# Altium schematic sheet MA-USBC.SchDoc
size A4; SheetNumber: 7; SheetTotal: 7
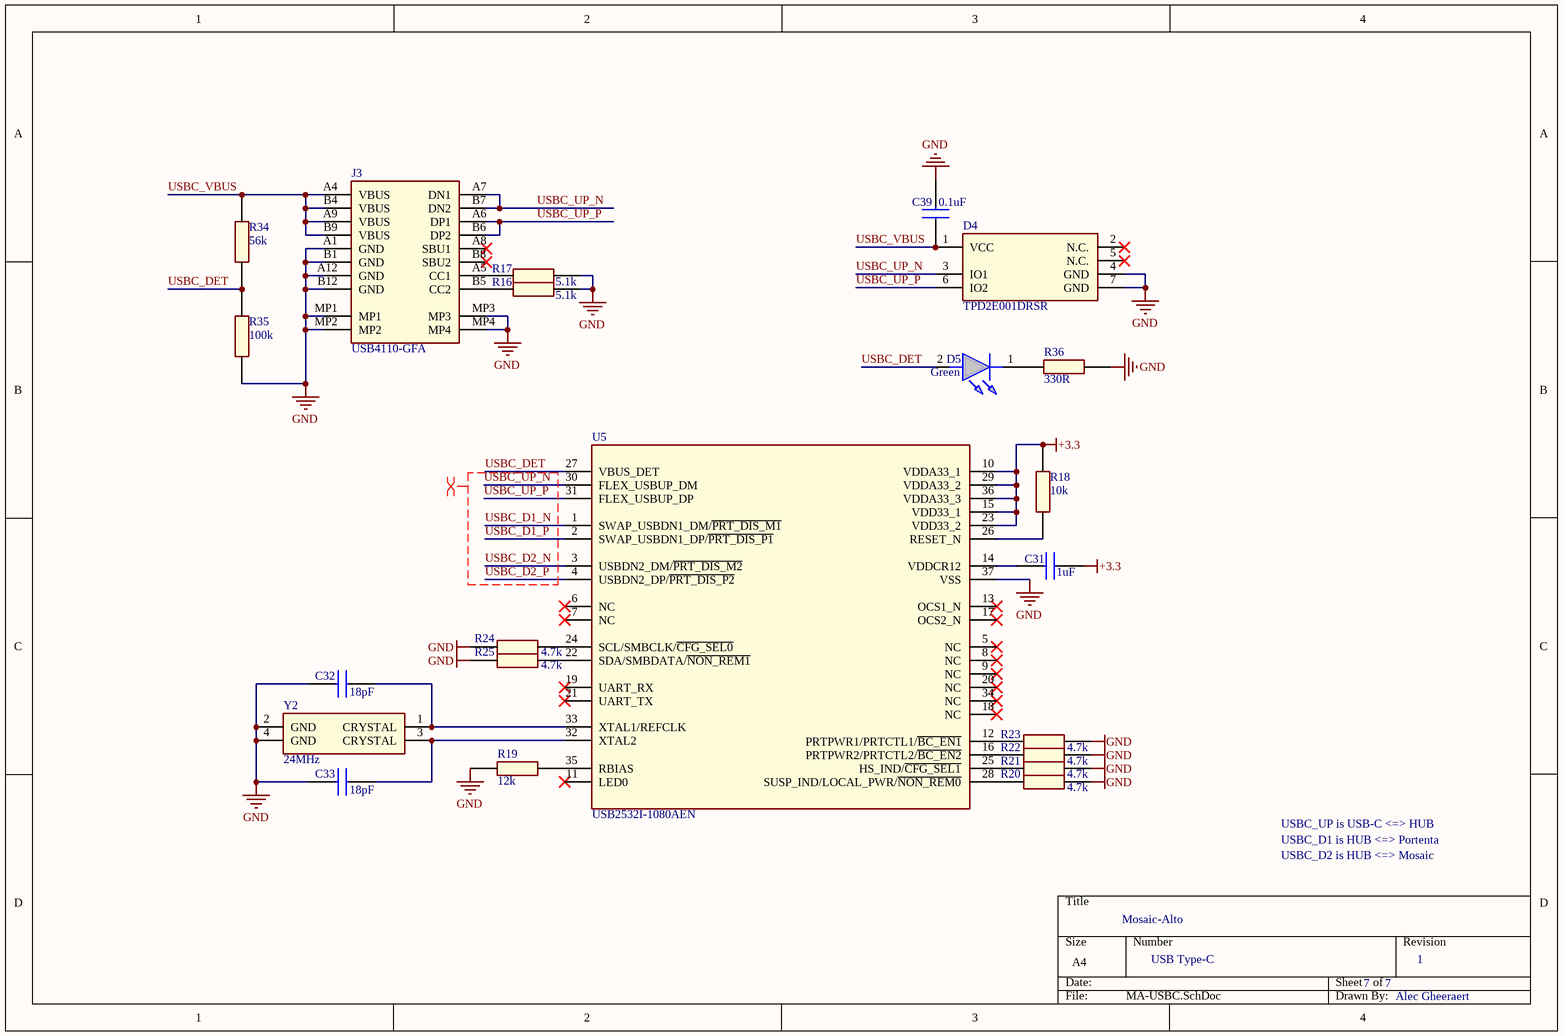
[diagram p0: MA-USBC.SchDoc]

## Parts
C31  1uF  [CAPC1608X100N]
C32  18pF  [CAPC1608X87N]
C33  18pF  [CAPC1608X87N]
C39  0.1uF  [CAPC2012X145N]
D4  TPD2E001DRSR  [SON95P300X300X80-7N-D]
D5  Green  [APT1608ZGCAMT]
J3  USB4110-GFA  [USB4110-GFA]
R16  5.1k  [RESC1608X60N]
R17  5.1k  [RESC1608X60N]
R18  10k  [RESC1005X40N]
R19  12k  [RESC1005X40N]
R20  4.7k  [RESC1005X40N]
R21  4.7k  [RESC1005X40N]
R22  4.7k  [RESC1005X40N]
R23  4.7k  [RESC1005X40N]
R24  4.7k  [RESC1005X40N]
R25  4.7k  [RESC1005X40N]
R34  56k  [RESC1005X40N]
R35  100k  [RESC1005X40N]
R36  330R  [RESC1005X40N]
U5  USB2532I-1080AEN  [QFN50P600X600X100-37N-D]
Y2  24MHz  [LFXTAL071257Reel]

## Nets
+3.3: C31.2 R18.2 U5.10(VDDA33_1) U5.15(VDD33_1) U5.23(VDD33_2) U5.29(VDDA33_2) U5.36(VDDA33_3)
GND: C32.1 C33.1 C39.2 D4.4(GND) D4.7(GND) J3.A1(GND) J3.A12(GND) J3.B1(GND) J3.B12(GND) J3.MP1 J3.MP2 J3.MP3 J3.MP4 R16.2 R17.2 R19.2 R20.2 R21.2 R22.2 R23.2 R24.1 R25.1 R35.2 R36.2 U5.37(VSS) Y2.2(GND) Y2.4(GND)
USBC_D1_N: U5.1(SWAP_USBDN1_DM/~{PRT_DIS_M1})
USBC_D1_P: U5.2(SWAP_USBDN1_DP/~{PRT_DIS_P1})
USBC_D2_N: U5.3(USBDN2_DM/~{PRT_DIS_M2})
USBC_D2_P: U5.4(USBDN2_DP/~{PRT_DIS_P2})
USBC_DET: D5.2(A) R34.2 R35.1 U5.27(VBUS_DET)
USBC_UP_N: D4.3(IO1) J3.A7(DN1) J3.B7(DN2) U5.30(FLEX_USBUP_DM)
USBC_UP_P: D4.6(IO2) J3.A6(DP1) J3.B6(DP2) U5.31(FLEX_USBUP_DP)
USBC_VBUS: C39.1 D4.1(VCC) J3.A4(VBUS) J3.A9(VBUS) J3.B4(VBUS) J3.B9(VBUS) R34.1
NetC31_1: C31.1 U5.14(VDDCR12)
NetC32_2: C32.2 U5.33(XTAL1/REFCLK) Y2.1(CRYSTAL)
NetC33_2: C33.2 U5.32(XTAL2) Y2.3(CRYSTAL)
NetD5_1: D5.1(K) R36.1
NetJ3_A5: J3.A5(CC1) R17.1
NetJ3_B5: J3.B5(CC2) R16.1
NetR18_1: R18.1 U5.26(RESET_N)
NetR19_1: R19.1 U5.35(RBIAS)
NetR20_1: R20.1 U5.28(SUSP_IND/LOCAL_PWR/~{NON_REM0})
NetR21_1: R21.1 U5.25(HS_IND/~{CFG_SEL1})
NetR22_1: R22.1 U5.16(PRTPWR2/PRTCTL2/~{BC_EN2})
NetR23_1: R23.1 U5.12(PRTPWR1/PRTCTL1/~{BC_EN1})
NetR24_2: R24.2 U5.24(SCL/SMBCLK/~{CFG_SEL0})
NetR25_2: R25.2 U5.22(SDA/SMBDATA/~{NON_REM1})

Not connected (* = marked no-connect by the designer): D4 2(N.C.)* 5(N.C.)*; J3 A8(SBU1)* B8(SBU2)*; U5 5(NC)* 6(NC)* 7(NC)* 8(NC)* 9(NC)* 11(LED0)* 13(OCS1_N)* 17(OCS2_N)* 18(NC)* 19(UART_RX)* 20(NC)* 21(UART_TX)* 34(NC)*

## Layout directives
differential pair; net class USBC; differential pair class USB: USBC_D1_N, USBC_D1_P, USBC_D2_N, USBC_D2_P, USBC_UP_N, USBC_UP_P

## Notes on the sheet
- USBC_UP is USB-C <=> HUB
- USBC_D1 is HUB <=> Portenta
- Mosaic-Alto
- USBC_D2 is HUB <=> Mosaic
- USB Type-C
- 7
- 1
- Alec Gheeraert

## Library data of the parts
C31 = CMP-00064-1: 0603 1µF; Manufacturer: Walsin; Tolerance: 10%; Dielectric: X5R; Voltage Rating: 6.3V; Package: 0603; Min Operating Temperature: -55; Max Operating Temperature: 85; Capacitance: 1µF
C32 C33 = CMP-00052-2: 0603 18pF; Manufacturer: Walsin; Dielectric: C0G; Tolerance: 5%; Voltage Rating: 16V; Max Operating Temperature: 125; Package: 0603; Min Operating Temperature: -55; Capacitance: 18pF
C39 = CMP-00059-1: 0805I 0.1µF; Manufacturer: Walsin; Voltage Rating: 50V; Capacitance: 100nF; Qualification: AEC-Q200; Dielectric: X7R; Tolerance: 10%; Min Operating Temperature: 125; Max Operating Temperature: -55; Package: 0805
D4 = CMP-00078-2: 2-Channel TVS Diode; Polarity: Unidirectional; Breakdown Voltage: 11V; Channels: 2; Clamping Voltage: 25V; Peak Pulse Current: 10A; Working Voltage: 5.5V; Max Operating Temperature: 85; Package: WSON-6; Min Operating Temperature: -40
D5 = CMP-00079-2: 0603 Green LED; Colour: Green
J3 = CMP-00039-5: USB-2.0 Type C; Manufacturer: Global Connector Technologies; Mounting Angle: Right; Current Rating: 5A; Voltage Rating: 48V; Gender: Female; Standard: 2.0; USB Type: C; Mounting Style: Top Mount
R16 R17 = CMP-00065-3: 0603I 5.1k; Manufacturer: Walsin; Voltage Rating: 50V; Qualification: AEC-Q200; Tolerance: 1%; Power Rating: 62.5mW; Min Operating Temperature: -55; Package: 0603; Max Operating Temperature: 155; Resistance: 5.1k
R18 = CMP-00026-5: 0402I 10k; Manufacturer: Walsin; Qualification: AEC-Q200; Tolerance: 1%; Voltage Rating: 50V; Power Rating: 62.5mW; Max Operating Temperature: 155; Resistance: 10k; Package: 0402; Min Operating Temperature: -55
R19 = CMP-00068-1: 0402I 12k; Manufacturer: Walsin; Power Rating: 62.5mW; Tolerance: 1%; Qualification: AEC-Q200; Voltage Rating: 50V; Max Operating Temperature: 155; Resistance: 12k; Package: 0402; Min Operating Temperature: -55
R20-R25 = CMP-00030-4: 0402I 4.7k; Manufacturer: Walsin; Power Rating: 62.5mW; Qualification: AEC-Q200; Voltage Rating: 50V; Tolerance: 1%; Max Operating Temperature: 155; Package: 0402; Min Operating Temperature: -55; Resistance: 4.7k
R34 = CMP-00075-1: 0402I 56k; Manufacturer: Walsin; Tolerance: 1%; Qualification: AEC-Q200; Voltage Rating: 50V; Power Rating: 62.5mW; Package: 0402; Resistance: 56k; Min Operating Temperature: -55; Max Operating Temperature: 155
R35 = CMP-00029-4: 0402I 100k; Manufacturer: Walsin; Voltage Rating: 50V; Power Rating: 62.5mW; Qualification: AEC-Q200; Tolerance: 1%; Package: 0402; Resistance: 100k; Max Operating Temperature: 155; Min Operating Temperature: -55
R36 = CMP-00028-4: 0402I 330; Manufacturer: Walsin; Resistance: 330; Qualification: AEC-Q200; Voltage Rating: 50V; Tolerance: 1%; Power Rating: 62.5mW; Max Operating Temperature: 155; Package: 0402; Min Operating Temperature: -55
U5 = CMP-00071-2: 2-Port USB-2.0 Controller Hub; Manufacturer: Microchip; Ports: 2; Data Rate: 480Mb/s; Package: SQFN-36; Standard: USB 2.0
Y2 = CMP-00067-2: 24MHz +/-100ppm Crystal; Manufacturer: IQD; Qualification: AEC-Q200; Tolerance: 10; Drive Level: 100µW; ESR: 100; Load Capacitance: 10pF; Min Operating Temperature: -40; Package: 2mm x 1.6mm; Frequency: 24MHz; Max Operating Temperature: 125